# EAGLE design motherboard (EAGLE 7.4.0)
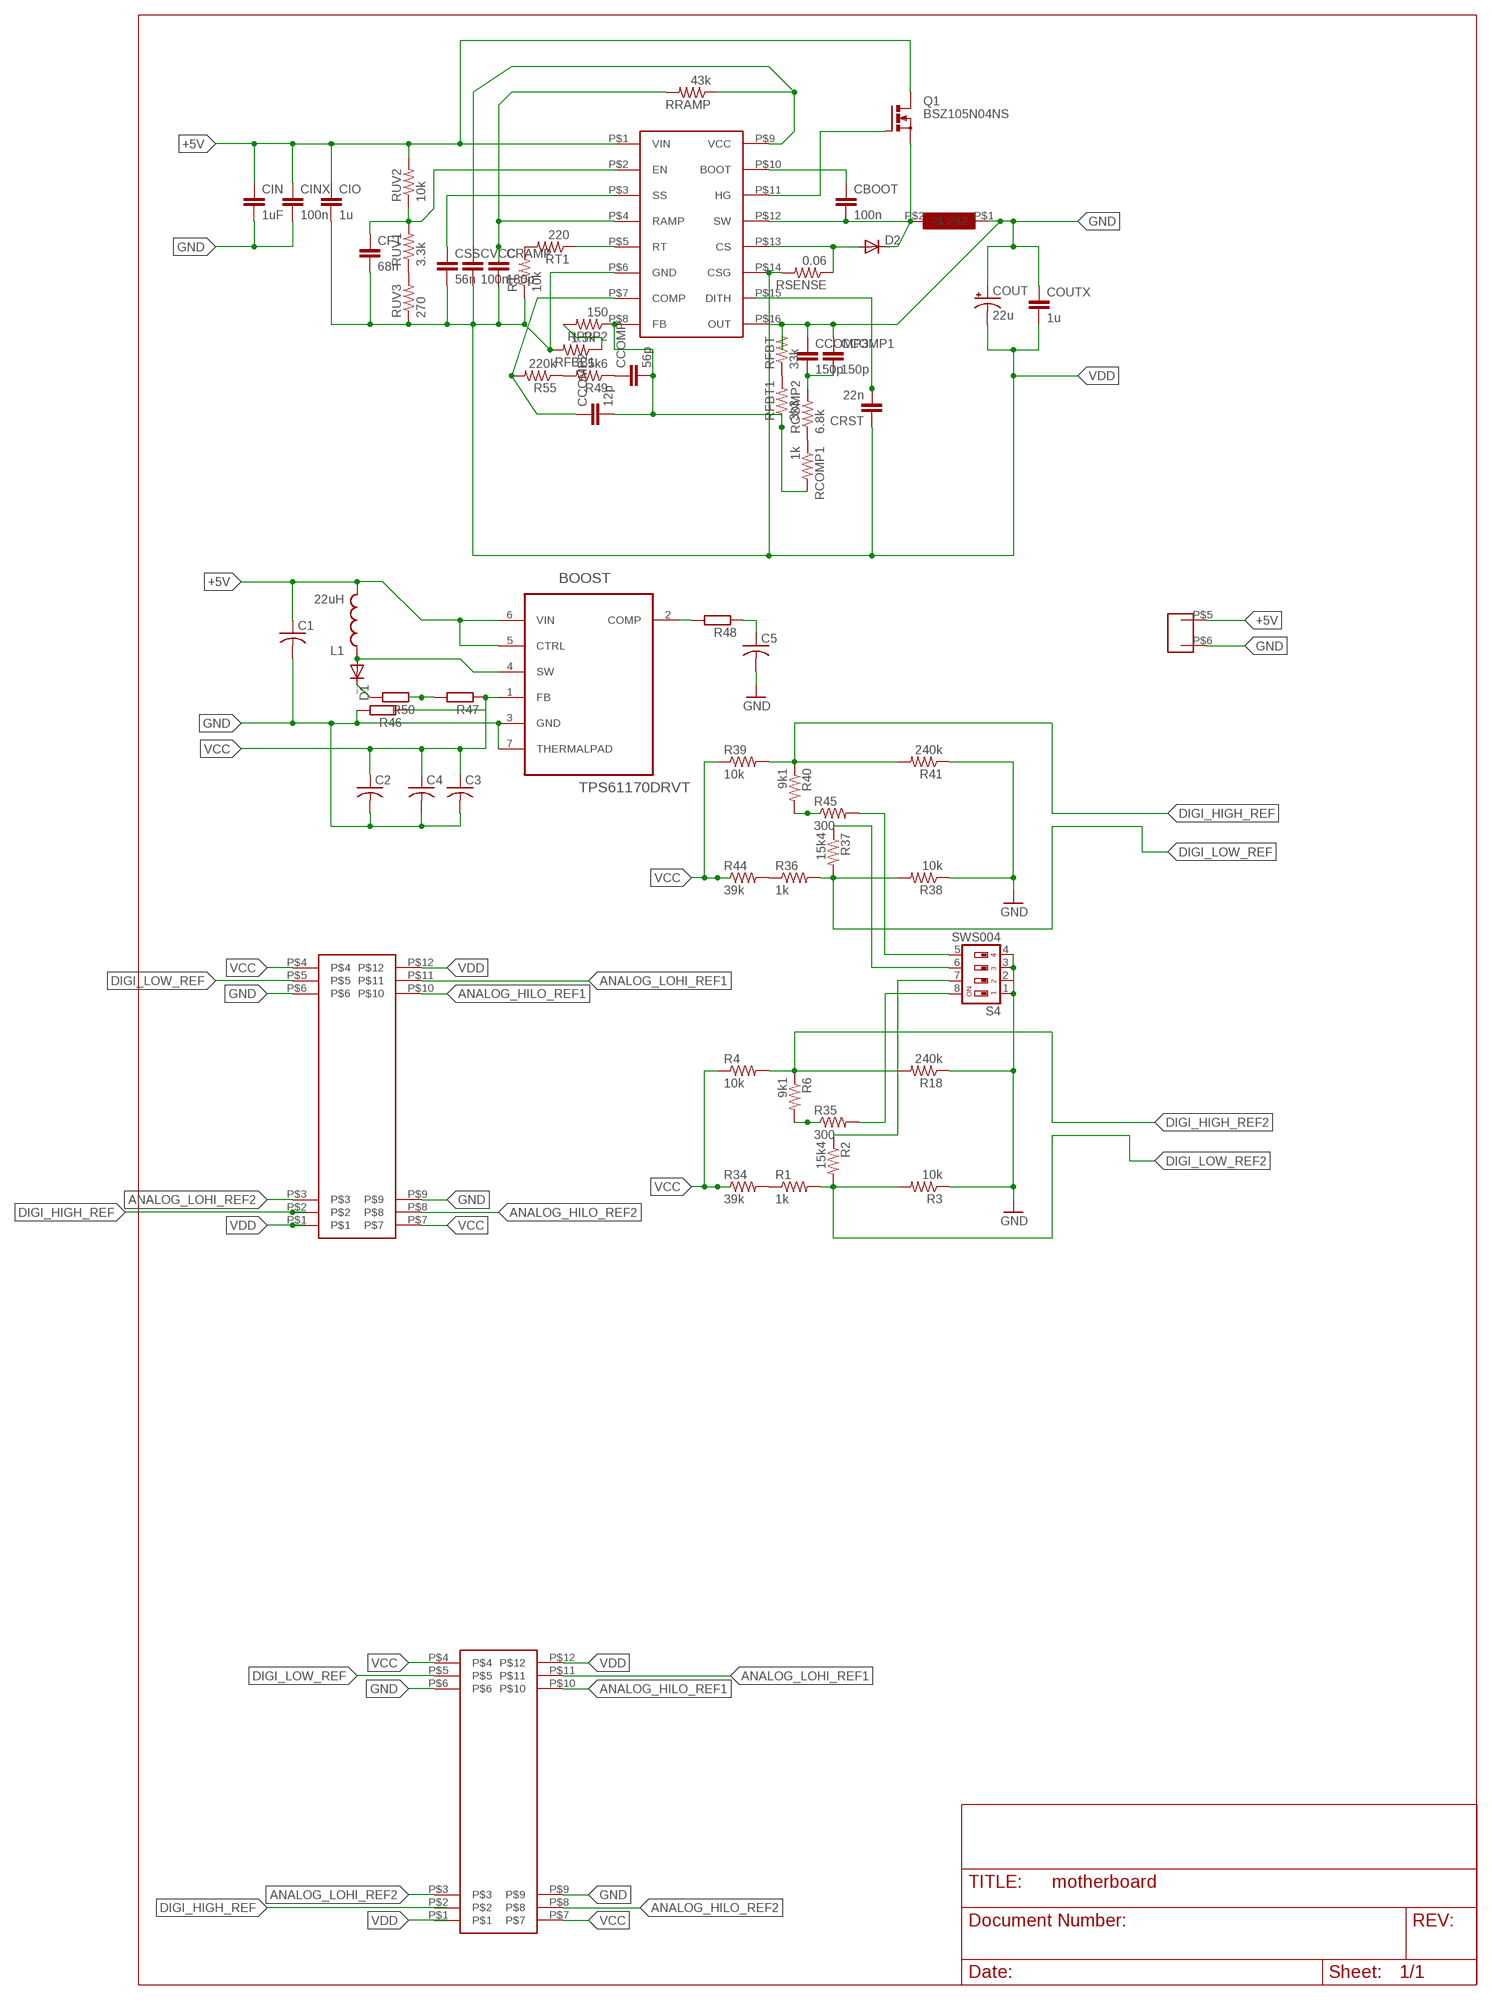
[diagram p0: schematic, sheet 1]

## Parts
BOOST  TPS61170DRVT  [SON65P210X210X80-7N]
C1  C-USC1206  [C1206]
C2  C-USC0805  [C0805]
C3  C-USC1206  [C1206]
C4  C-USC1206  [C1206]
C5  C-USC1206  [C1206]
CBOOT  100n  C-EUC0805  [C0805]
CCOMP  56p  C-EUC0805  [C0805]
CCOMP1  150p  C-EUC0805  [C0805]
CCOMP2  12p  C-EUC0805  [C0805]
CCOMP3  150p  C-EUC0805  [C0805]
CFT  68n  C-EUC0805  [C0805]
CIN  1uF  C-EUC0805  [C0805]
CINX  100n  C-EUC0805  [C0805]
CIO  1u  C-EUC0805  [C0805]
COUT  22u  CPOL-USE5-5  [E5-5]
COUTX  1u  C-EUC0805  [C0805]
CRAMP  180p  C-EUC0805  [C0805]
CRST  22n  C-EUC0805  [C0805]
CSS  56n  C-EUC0805  [C0805]
CVCC  100n  C-EUC0805  [C0805]
D1  DIODE-SOD123  [SOD123]
D2  DIODE-SOD123  [SOD123]
L1  22uH  INDUCTORBOURNS_SRN6045  [SRN6045]
Q1  BSZ105N04NS  [PG-TDSON-8]
R1  1k  R-US_R0805  [R0805]
R2  15k4  R-US_R0805  [R0805]
R3  10k  R-US_R0805  [R0805]
R4  10k  R-US_R0805  [R0805]
R6  9k1  R-US_R0805  [R0805]
R18  240k  R-US_R0805  [R0805]
R34  39k  R-US_R0805  [R0805]
R35  300  R-US_R0805  [R0805]
R36  1k  R-US_R0805  [R0805]
R37  15k4  R-US_R0805  [R0805]
R38  10k  R-US_R0805  [R0805]
R39  10k  R-US_R0805  [R0805]
R40  9k1  R-US_R0805  [R0805]
R41  240k  R-US_R0805  [R0805]
R44  39k  R-US_R0805  [R0805]
R45  300  R-US_R0805  [R0805]
R46  R-EU_R0805  [R0805]
R47  R-EU_R0805  [R0805]
R48  R-EU_R0805  [R0805]
R49  5k6  R-US_R0805  [R0805]
R50  R-EU_R0805  [R0805]
R55  220k  R-US_R0805  [R0805]
RCOMP1  1k  R-US_R0805  [R0805]
RCOMP2  6.8k  R-US_R0805  [R0805]
RFBB1  1.5k  R-US_R0805  [R0805]
RFBT  33k  R-US_R0805  [R0805]
RFBT1  3k3  R-US_R0805  [R0805]
RFPP2  150  R-US_R0805  [R0805]
RRAMP  43k  R-US_R0805  [R0805]
RSENSE  0.06  R-US_R0805  [R0805]
RT  10k  R-US_R0805  [R0805]
RT1  220  R-US_R0805  [R0805]
RUV1  3.3k  R-US_R0805  [R0805]
RUV2  10k  R-US_R0805  [R0805]
RUV3  270  R-US_R0805  [R0805]
S4  SWS004  [SMS-004]
U$1  MODULE_CONNECTOR  [MODULE_CONNECTOR]
U$2  LM5088  [LM5088]
U$3  KLICK_INDUCTOR01  [KLICK_INDUCTOR01]
U$4  5.08PITCHTERMINAL  [10KPL508]
U$5  MODULE_CONNECTOR  [MODULE_CONNECTOR]

## Nets
+5V: BOOST.5(CTRL) BOOST.6(VIN) C1.1 CIN.1 CINX.1 CIO.1 L1.2 Q1.5(D) Q1.6(D) Q1.7(D) Q1.8(D) Q1.TH(D) RUV2.2 U$2.P$1(VIN) U$4.P$5
ANALOG_HILO_REF1: U$1.P$10 U$5.P$10
ANALOG_HILO_REF2: U$1.P$8 U$5.P$8
ANALOG_LOHI_REF1: U$1.P$11 U$5.P$11
ANALOG_LOHI_REF2: U$1.P$3 U$5.P$3
DIGI_HIGH_REF: R39.2 R40.1 R41.2 U$1.P$2
DIGI_HIGH_REF2: R4.2 R6.1 R18.2
DIGI_LOW_REF: R36.2 R37.2 R38.2 U$1.P$5 U$5.P$5
DIGI_LOW_REF2: R1.2 R2.2 R3.2
GND: BOOST.3(GND) BOOST.7(THERMALPAD) C1.2 C2.2 C3.2 C4.2 C5.2 CCOMP1.1 CCOMP3.1 CIN.2 CINX.2 COUT.+ COUTX.1 R3.1 R18.1 R38.1 R41.1 R46.2 RFBT.2 S4.1 S4.2 S4.3 S4.4 U$1.P$6 U$1.P$9 U$2.P$16(OUT) U$3.P$1 U$4.P$6 U$5.P$6 U$5.P$9
N$4: R2.1 S4.7
N$5: R6.2 R35.1
N$15: R1.1 R34.2
N$42: R35.2 S4.8
N$43: CFT.1 RUV1.2 RUV2.1 U$2.P$2(EN)
N$44: BOOST.4(SW) D1.A L1.1
N$45: CSS.1 U$2.P$3(SS)
N$47: R47.2 R50.1
N$48: CVCC.1 RRAMP.1 U$2.P$9(VCC)
N$49: BOOST.2(COMP) R48.2
N$51: C5.1 R48.1
N$52: D2.A RSENSE.1 U$2.P$13(CS)
N$53: CRAMP.1 RRAMP.2 U$2.P$4(RAMP)
N$54: RT1.2 RT.2
N$55: RUV1.1 RUV3.2
N$56: CCOMP.1 R49.1
N$57: CCOMP2.2 CCOMP.2 RCOMP1.2 RFBT1.1 RFPP2.1 U$2.P$8(FB)
N$58: CCOMP2.1 R55.2 U$2.P$7(COMP)
N$59: CBOOT.1 U$2.P$10(BOOT)
N$60: CRST.2 U$2.P$15(DITH)
N$61: CBOOT.2 D2.C Q1.1(S) Q1.2(S) Q1.3(S) U$2.P$12(SW) U$3.P$2
N$62: RFBB1.1 RFPP2.2
N$65: Q1.4(G) U$2.P$11(HG)
N$66: R49.2 R55.1
N$67: R37.1 S4.6
N$68: R36.1 R44.2
N$69: R40.2 R45.1
N$70: R45.2 S4.5
N$71: CCOMP1.2 CCOMP3.2 RCOMP2.2
N$72: RT1.1 U$2.P$5(RT)
N$73: RCOMP1.1 RCOMP2.1
N$74: RFBT1.2 RFBT.1
N$75: D1.C R50.2
VCC: BOOST.1(FB) C2.1 C3.1 C4.1 R4.1 R34.1 R39.1 R44.1 R46.1 R47.1 U$1.P$4 U$1.P$7 U$5.P$4 U$5.P$7
VDD: CFT.2 CIO.2 COUT.- COUTX.2 CRAMP.2 CRST.1 CSS.2 CVCC.2 RFBB1.2 RSENSE.2 RT.1 RUV3.1 U$1.P$1 U$1.P$12 U$2.P$6(GND) U$2.P$14(CSG) U$5.P$12
Unconnected: U$5.P$1 U$5.P$2

## Library data of the parts
BOOST = Texas Instruments_By_element14_Batch_1:TPS61170DRVT: 1.2A High Voltage Boost Converter in 2x2mm2 QFN Package; MPN: TPS61170DRVT; OC_FARNELL: 1703404; OC_NEWARK: 65M6342; PACKAGE: SON-6; SUPPLIER: Texas Instruments
C1-C5 = rcl:C-US: CAPACITOR, American symbol
CBOOT CCOMP CCOMP1-CCOMP3 CFT CIN CINX CIO COUTX CRAMP CRST CSS CVCC = rcl:C-EU: CAPACITOR, European symbol
COUT = rcl:CPOL-US: POLARIZED CAPACITOR, American symbol
D1 D2 = diode:DIODE-: DIODE
L1 = SparkFun-Passives:INDUCTOR: Inductors Basic Inductor/Choke - 0603 and 1206. Footprints are not proven and vary greatly between part numbers. INDUCTOR POWER 3.3UH 4.0A SMD 0.197" L x 0.197" W x 0.177" H (5.00mm x 5.00mm x 4.50mm); PROD_ID: NDUC-11627; VALUE: 33uH
Q1 = transistor-power:BSZ105N04NS: OptiMOS (TM)3 Power-Transistor N-Channel, Normal level Source : Data sheet <http://www.infineon.com/dgdl/BSZ105N04NSG_rev1.1.pdf?folderId=db3a3043156fd5730115c7d50620107c&fileId=db3a30431689f4420116c485c67f084e>
R1-R4 R6 R18 R34-R41 R44 R45 R49 R55 RCOMP1 RCOMP2 RFBB1 RFBT RFBT1 RFPP2 RRAMP RSENSE RT RT1 RUV1-RUV3 = rcl:R-US_: RESISTOR, American symbol
R46-R48 R50 = rcl:R-EU_: RESISTOR, European symbol
S4 = smd-special:SWS004: SMD Dip Switch 4 pol.
U$1 U$5 = UADIVOLECO_module_connector:MODULE_CONNECTOR
U$2 = Klick_custom_lm5088:LM5088
U$3 = Klick_inductor01:KLICK_INDUCTOR01
U$4 = ruuviliitin_2pin:5.08PITCHTERMINAL

## Board
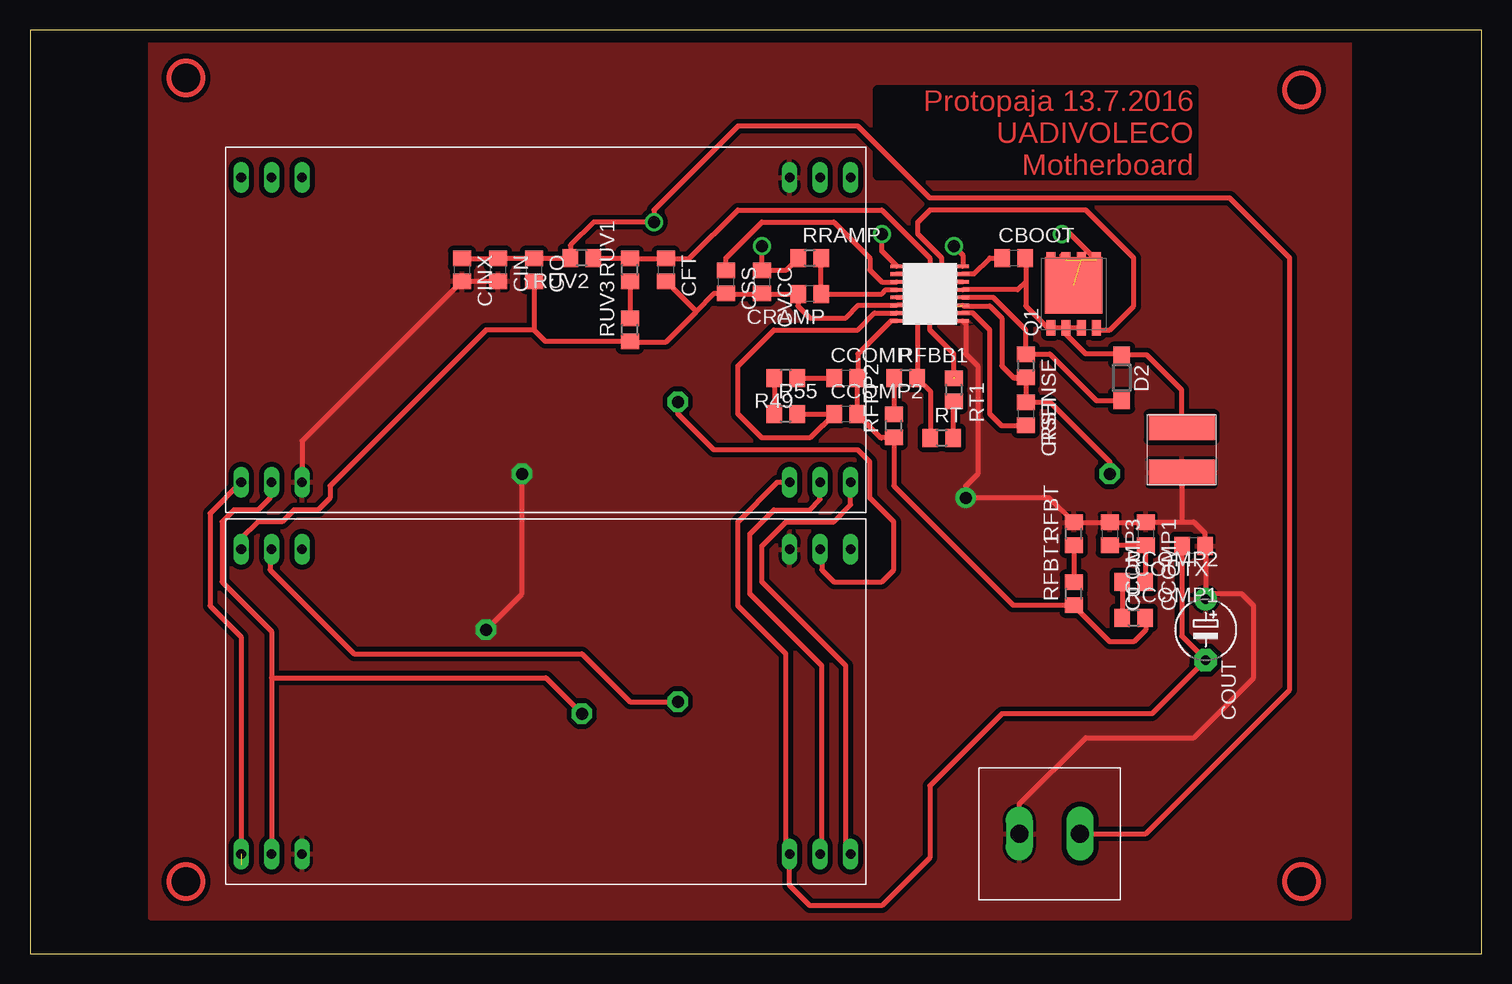
[diagram p1: board, top side]
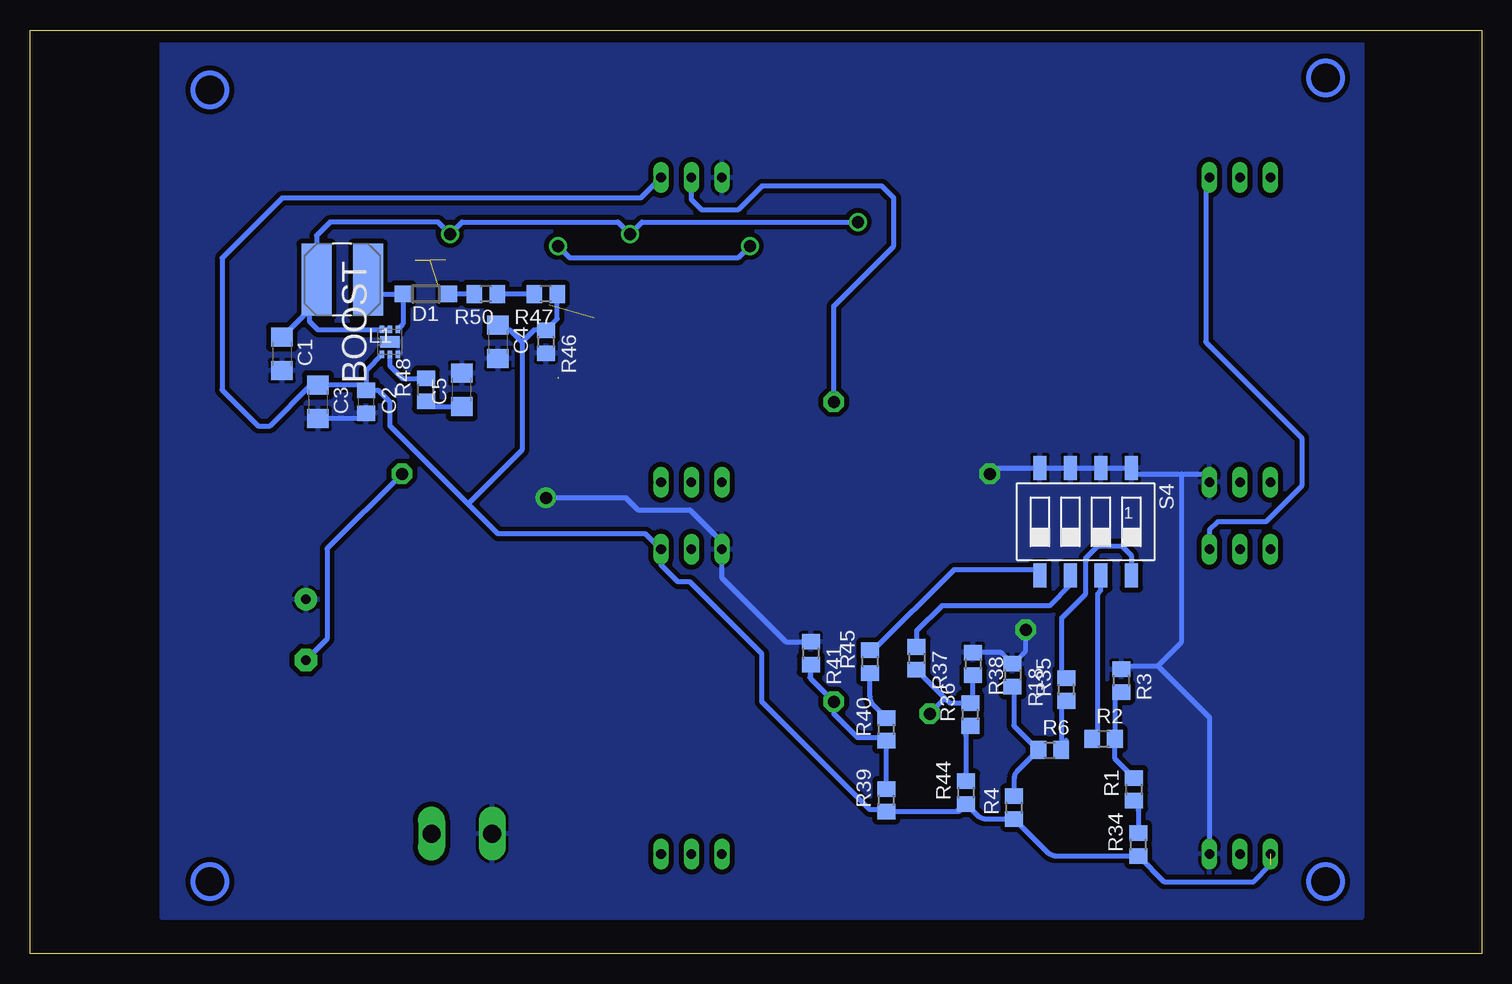
[diagram p2: board, bottom side, seen from below]

Size 121 x 77 mm. Coordinates in mm from the lower left corner, seen from the top.
Outline: 0,0 121,0 121,77 0,77 0,0
Copper layers (1*16): Top 0.035mm / dielectric 1.5mm / Bottom 0.035mm
Design rules "default": minimum track width 10mil, minimum drill 24mil, track to track 8mil, track to pad 8mil, pad to pad 8mil, via to via 8mil, smd to smd 8mil, copper to edge 40mil, drill to drill 8mil, minimum pad ring 10mil, minimum via ring 8mil, stop-mask expansion 4mil, vias tented up to drill 0mil, thermal gap 10mil

### Footprints (pad centres in the part's own frame; a part is rotated, then mirrored left to right if it is on the bottom)
SON65P210X210X80-7N = smd 0.61 x 0.356: 1 -1.041,0.66; 2 -1.041,0; 3 -1.041,-0.66; 4 1.041,-0.66; 5 1.041,0; 6 1.041,0.66 | smd 0.991 x 1.6: 7 0,0
C1206 = smd 1.6 x 1.8: 1 -1.4,0; 2 1.4,0
C0805 = smd 1.3 x 1.5: 1 -0.95,0; 2 0.95,0
E5-5 = drill 0.813 pad 1.905: + -2.54,0 | drill 0.813 pad 1.905 octagon: - 2.54,0
SOD123 = smd 1.4 x 1.4: A 1.9,0; C -1.9,0
SRN6045 = smd 2.5 x 6: 1 -2.175,-0.175; 2 2.125,-0.175
PG-TDSON-8 = smd 1.3 x 0.75: 1 -2.825,1.905; 2 -2.825,0.635; 3 -2.825,-0.635; 4 -2.825,-1.905; 5 2.825,-1.905; 6 2.825,-0.635; 7 2.825,0.635; 8 2.825,1.905 | smd 4.7 x 4.8: TH 0.725,0
R0805 = smd 1.3 x 1.5: 1 -0.95,0; 2 0.95,0
SMS-004 = smd 1.092 x 2.007: 1 -3.81,-4.496; 2 -1.27,-4.496; 3 1.27,-4.496; 4 3.81,-4.496; 5 3.81,4.496; 6 1.27,4.496; 7 -1.27,4.496; 8 -3.81,4.496
MODULE_CONNECTOR = drill 0.8 long: P$1 -25.4,12.7; P$2 -22.86,12.7; P$3 -20.32,12.7; P$4 -25.4,-12.7; P$5 -22.86,-12.7; P$6 -20.32,-12.7; P$7 25.4,12.7; P$8 22.86,12.7; P$9 20.32,12.7; P$10 25.4,-12.7; P$11 22.86,-12.7; P$12 20.32,-12.7
LM5088 = smd 1.05 x 0.3: P$1 -2.75,2.3; P$2 -2.75,1.65; P$3 -2.75,1; P$4 -2.75,0.35; P$5 -2.75,-0.3; P$6 -2.75,-0.95; P$7 -2.75,-1.6; P$8 -2.75,-2.25; P$9 2.75,2.3; P$10 2.75,1.65; P$11 2.75,1; P$12 2.75,0.35; P$13 2.75,-0.3; P$14 2.75,-0.95; P$15 2.75,-1.6; P$16 2.75,-2.25
KLICK_INDUCTOR01 = smd 2.15 x 5.5: P$1 -1.9,0; P$2 1.9,0
10KPL508 = drill 1.5 long: P$5 -2.54,0; P$6 2.54,0

### Placement (x,y rotation side)
BOOST  91,51 90 bottom
C1  100,50 270 bottom
C2  93,46 270 bottom
C3  97,46 270 bottom
C4  82,51 270 bottom
C5  85,47 90 bottom
CBOOT  82,58 0 top
CCOMP  68,48 0 top
CCOMP1  93,35 270 top
CCOMP2  68,45 0 top
CCOMP3  90,35 270 top
CFT  53,57 270 top
CIN  39,57 270 top
CINX  36,57 270 top
CIO  42,57 270 top
COUT  98,27 270 top
COUTX  97,34 180 top
CRAMP  65,55 180 top
CRST  83,45 270 top
CSS  58,56 270 top
CVCC  61,56 270 top
D1  88,55 180 bottom
D2  91,48 270 top
L1  95,56 180 bottom
Q1  87,55 90 top
R1  28.96,13.69 90 bottom
R2  31.51,17.91 0 bottom
R3  30.04,22.75 270 bottom
R4  38.96,12.17 90 bottom
R6  35.99,16.96 0 bottom
R18  39.09,23.21 270 bottom
R34  28.61,9.09 90 bottom
R35  34.61,22.01 90 bottom
R36  42.61,19.93 90 bottom
R37  47.09,24.61 270 bottom
R38  42.39,24.15 270 bottom
R39  49.61,12.77 90 bottom
R40  49.61,18.69 90 bottom
R41  55.91,25.04 270 bottom
R44  42.96,13.41 90 bottom
R45  50.96,24.33 90 bottom
R46  78,51 270 bottom
R47  78,55 180 bottom
R48  88,47 90 bottom
R49  63,48 180 top
R50  83,55 180 bottom
R55  63,45 0 top
RCOMP1  92,28 0 top
RCOMP2  92,31 0 top
RFBB1  73,48 0 top
RFBT  87,35 90 top
RFBT1  87,30 90 top
RFPP2  72,44 90 top
RRAMP  65,58 0 top
RSENSE  83,49 270 top
RT  76,43 0 top
RT1  77,47 270 top
RUV1  50,57 90 top
RUV2  46,58 180 top
RUV3  50,52 90 top
S4  33,36 180 bottom
U$1  43,21 0 top
U$2  75,55 0 top
U$3  96,42 90 top
U$4  85,10 180 top
U$5  43,52 0 top

### Tracks (layer width: path | path; a pad name or v marks a point on that pad's centre or on a via)
+5V  (via drill 1 pad 1.42)  (3 unrouted)
  Top 0.406: Q1.8 Q1.7 86,58.19 | U$2.P$1 71,58.55 v71,60 | Q1.5 86.73,60 v86,60 | U$4.P$5 93,10 105,22 105,58 100,63 75,63 69,69 59,69 52,62 v52,61 47,61 45.05,59.05 RUV2.2 45,57.95 CIO.1 CIN.1 CINX.1
  Bottom 0.406: v52,61 70,61 v71,60 72,61 85,61 v86,60 87,61 96,61 97.12,59.88 L1.2 97.12,54.27 97.7,53.7 | BOOST.5 BOOST.6 91.7,52 97,52 97.7,52.7 97.7,53.7 | C1.1 97.7,53.7
ANALOG_HILO_REF1
  Top 0.406: U$1.P$10 68,8.7 68,24 61,31 61,34 63,36 67,36 68.4,37.4 U$5.P$10
ANALOG_HILO_REF2  (via drill 1 pad 1.68)
  Top 0.406: U$1.P$8 66,33.56 66,32 67,31 71,31 72,32 72,36 70,38 70,41 69,42 57,42 54,45 v54,46
  Bottom 0.406: v54,46 54,54 49,59 49,63 50,64 60,64 62,62 65,62 65.86,62.86 U$5.P$8
ANALOG_LOHI_REF1
  Top 0.406: U$1.P$11 66,8.44 66,24 60,30 60,35 62,37 65,37 65.86,37.86 U$5.P$11
ANALOG_LOHI_REF2
  Bottom 0.406: U$5.P$3 23,64.38 23,51 15,43 15,39 18,36 22,36 22.68,35.32 U$1.P$3
DIGI_HIGH_REF  (via drill 1 pad 1.68)
  Top 0.406: U$1.P$2 20,33.56 20,32 27,25 46,25 50,21 v54,21
  Bottom 0.406: R39.2 R40.1 49.87,18 52,18 54,20 v54,21 55.91,22.91 R41.2 56,24 56,23
DIGI_HIGH_REF2
  Bottom 0.406: R4.2 38.96,14.53 arc45 38.67,15.23 R6.1 arc45 36.97,16.97 39,19 39,22.04 arc-45 R18.2
DIGI_LOW_REF  (via drill 1 pad 1.68)
  Top 0.406: U$5.P$5 20,39.16 20,38 19,37 17,37 16,36 16,31 20.14,26.86 20.14,23 | 20.14,23 U$1.P$5 | 20.14,23 43,23 v46,20
  Bottom 0.406: R38.2 42.39,21.1 R36.2 44.31,20.88 44.72,21.29 | R37.2 44.72,21.29 | v46,20 44.72,21.29
DIGI_LOW_REF2
  Bottom 0.406: R1.2 30.56,16.24 R2.2 30.56,21.28 R3.2
GND  (via drill 1 pad 1.68)
  Top 0.406: U$2.P$16 78,52.5 78,50 79,49 79,40 78,39 v78,38 84.95,38 RFBT.2 CCOMP3.1 CCOMP1.1 93.05,36 96,36 | 96,36 97,36 97.95,35.05 COUTX.1 98,33.95 COUT.+ 98.46,30 101,30 102,29 102,23 97,18 88,18 82.46,12.46 U$4.P$6 | U$3.P$1 96,36 | U$5.P$6 22.68,42.73 CINX.2 CIN.2 | v38,27 41,30 v41,40
  Bottom 0.406: v78,38 71.31,38 70.31,37 66,37 63.32,34.32 U$1.P$9 63.32,31.32 57.99,25.99 R41.1 | C2.2 93.45,44.6 C3.2 | R46.2 78.45,49.6 | BOOST.3 90.3,50 | R3.1 29.74,24 27,24 | 27,24 22.68,19.68 U$1.P$6 | 25,40 28.69,40 S4.1 S4.2 S4.3 S4.4 40.5,40.5 v41,40 | 25,40 23,40 22.68,39.68 U$5.P$6 | 27,24 25,26 25,40 | R38.1 40.03,25.1 R18.1 38,25.25 v38,27
  pour Top (isolate 0.406): 10,74 10,3 110,3 110,76 10,76 10,75
  pour Bottom (isolate 0.406): 10,76 10,3 110,3 110,76
N$4
  Bottom 0.406: R2.1 32,18.37 32,30 31.73,30.27 S4.7
N$5
  Bottom 0.406: 34.61,17.8 arc45 34.9,17.1 R6.2 35.04,20.63 R35.1
N$15
  Bottom 0.406: R1.1 28.9,12.68 arc45 28.61,11.98 R34.2
N$42
  Bottom 0.406: R35.2 35,23.35 35,28 33,30 33,33 32,34 30,34 29.19,33.19 S4.8
N$43
  Top 0.406: RUV2.1 49.95,58 RUV1.2 CFT.1 54.95,57.95 59,62 71,62 75,58 75,57 74.65,56.65 U$2.P$2
N$44
  Bottom 0.406: BOOST.4 89.9,52.48 D1.A 91.65,55 L1.1
N$45
  Top 0.406: CSS.1 58,58 61,61 67,61 70,58 70,57 71,56 U$2.P$3
N$47
  Bottom 0.406: R47.2 R50.1
N$48  (via drill 1 pad 1.42)
  Top 0.406: RRAMP.1 63,56.95 CVCC.1 v61,59 | v77,59 77.75,58.25 U$2.P$9
  Bottom 0.406: v61,59 62,58 76,58 v77,59
N$49
  Bottom 0.406: BOOST.2 91,49 89.95,47.95 R48.2
N$51
  Bottom 0.406: R48.1 87.55,45.6 C5.1
N$52
  Top 0.406: D2.A 88.9,46.1 85,50 83.05,50 RSENSE.1 83,52 80.3,54.7 U$2.P$13
N$53
  Top 0.406: RRAMP.2 CRAMP.1 71,55 71.35,55.35 U$2.P$4
N$54
  Top 0.406: RT1.2 76.95,46 RT.2
N$55
  Top 0.406: RUV1.1 RUV3.2
N$56
  Top 0.406: R49.1 CCOMP.1
N$57
  Top 0.406: RCOMP1.2 93,27.95 93,27 92,26 90,26 87,29 RFBT1.1 81.95,29.05 72,39 RFPP2.1 71.05,43.05 71,43 70.95,43 CCOMP2.2 CCOMP.2 69,48.05 69,50 71.75,52.75 U$2.P$8
N$58
  Top 0.406: R55.2 CCOMP2.1 66.05,44 66,44 65,43 61,43 59,45 59,49 62,52 69,52 70.4,53.4 U$2.P$7
N$59
  Top 0.406: U$2.P$10 78.65,56.65 80,58 CBOOT.1
N$60
  Top 0.406: CRST.2 82.95,44 81,44 80,45 80,52 78.6,53.4 U$2.P$15
N$61
  Top 0.406: Q1.2 Q1.1 84.83,52.17 83,54 83,56 | Q1.2 Q1.3 | Q1.2 86.36,51.63 88,50 90.9,50 D2.C 93.1,49.9 96,47 U$3.P$2 | CBOOT.2 83,57.95 83,56 | 83,56 82.35,55.35 U$2.P$12
N$62
  Top 0.406: RFPP2.2 72.05,45 RFBB1.1
N$65
  Top 0.406: U$2.P$11 76,56 76,58 74,60 74,61 75,62 88,62 92,58 92,54 90,52 89.08,52 Q1.4
N$66
  Top 0.406: R49.2 R55.1
N$67
  Bottom 0.406: S4.6 34.27,30.73 36,29 45,29 47.09,26.91 R37.1
N$68
  Bottom 0.406: 42.61,14.71 R44.2 42.96,14.9 arc-45 43,15 43,18.18 arc45 42.71,18.88 R36.1
N$69
  Bottom 0.406: R40.2 50.67,20.7 arc45 50.96,21.4 R45.1
N$70
  Bottom 0.406: S4.5 37.31,32 44,32 50.72,25.28 R45.2
N$71
  Top 0.406: CCOMP3.2 CCOMP1.2 93,31.05 RCOMP2.2
N$72  (1 unrouted)
  Top 0.406: U$2.P$5 74.3,54.7 75,54 75,52 77,50 77,48.05
N$73
  Top 0.406: RCOMP2.1 RCOMP1.1
N$74
  Top 0.406: RFBT.1 RFBT1.2
N$75
  Bottom 0.406: R50.2 D1.C
VCC  (1 unrouted)
  Top 0.406: U$5.P$4 15,36.7 15,29 17.6,26.4 U$1.P$4
  Bottom 0.406: R44.1 43.6,11.82 | R44.1 43.31,12.11 arc45 44.01,11.82 R39.1 49.79,12 51,12 60,21 60,25 66,31 67,31 68.4,32.4 U$1.P$7 69.7,35 82,35 84.5,37.5 | R44.1 42.01,11.51 arc-45 41.31,11.22 R4.1 36.17,8.43 arc-45 35.47,8.14 R34.1 26.47,6 19,6 17.6,7.4 | C2.1 93.45,47.4 C3.1 97.6,47.4 101,44 102,44 105,47 105,58 100,63 70.1,63 U$5.P$7 | R47.1 77.05,52.9 R46.1 78.05,52 79,52 80,51 | BOOST.1 93,48.62 C2.1 | 84.5,37.5 91,44 91,46 91.95,46.95 C2.1 | 80,51 80,42 84.5,37.5 | C4.1 81.6,52 81,52 80,51
VDD  (via drill 1 pad 1.68)  (1 unrouted)
  Top 0.406: RT.1 75.05,46.9 RFBB1.2 74,48.05 74,53 72.95,54.05 U$2.P$6 69.05,54.05 68,53 65,53 64,54 64,54.95 CRAMP.2 61.05,55 CVCC.2 61,55 58.05,55 CSS.2 57.05,55.05 55.5,53.5 | CIO.2 42,52 | 42,52 42.95,51.05 RUV3.1 50.05,51 53,51 55.5,53.5 | 42,52 38,52 25,39 25,38 24,37 22,37 21,36 19,36 17.6,34.6 U$1.P$1 | U$5.P$12 62.3,39.3 59,36 59,29 63,25 63,8.62 U$1.P$12 63.32,5.68 65,4 71,4 75,8 75,14 81,20 93.54,20 COUT.- 96,26.46 96,33.95 COUTX.2 | CFT.2 55.5,53.55 55.5,53.5 | 83,48 RSENSE.2 81.95,48.05 | 83,46 CRST.1 | 81.95,48.05 81,49 81,53 80,54 77.8,54 U$2.P$14 | 81.95,48.05 82,48 83,48 | 83,48 83,46 | 83,46 85,46 90,41 v90,40
  Bottom 0.406: v90,40 96.23,33.77 96.23,26.23 COUT.-
(copper drawn outside any net)
  shapes: Bottom circle x4, Top circle x4

### Text on the board
Top: Protopaja 13.7.2016 / UADIVOLECO / Motherboard